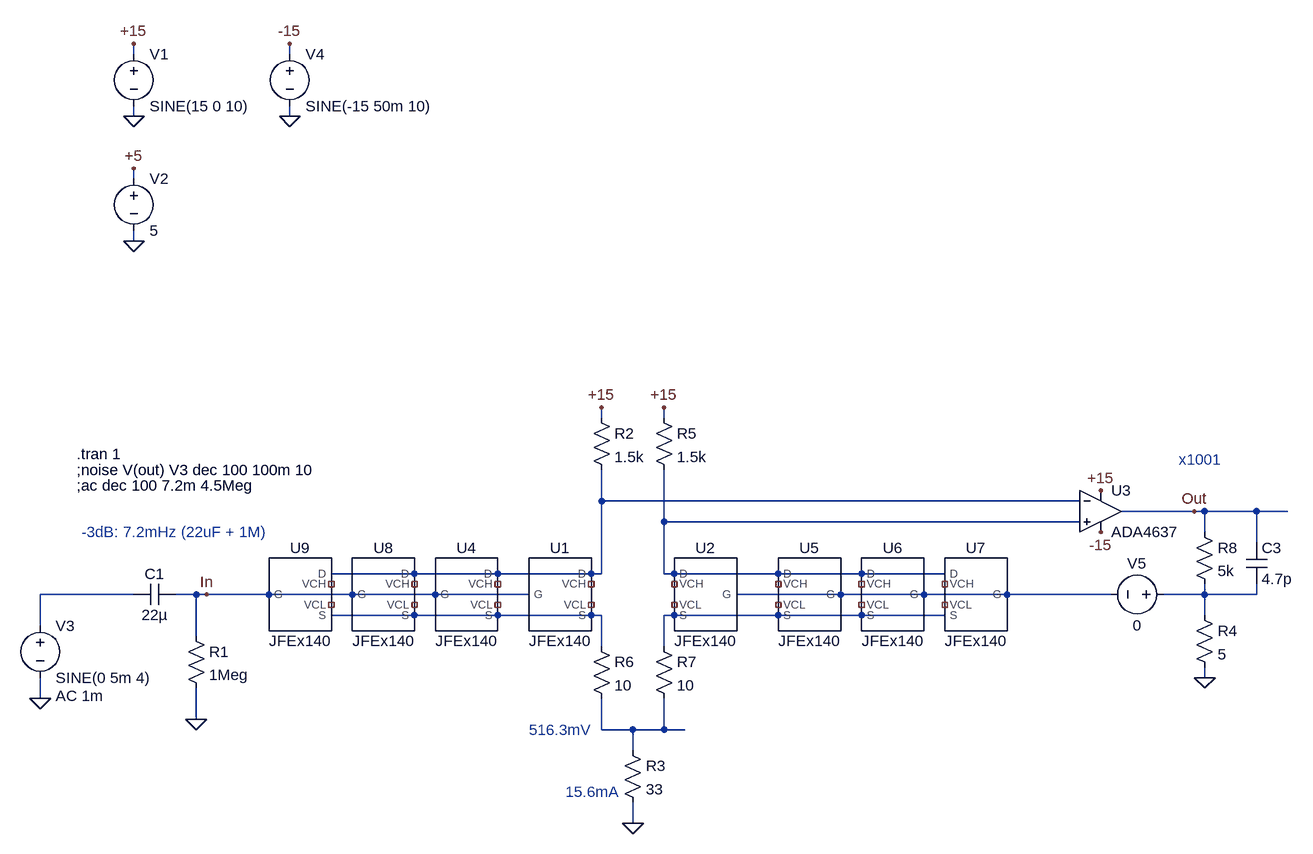
[diagram p0: schematic Differential JFET amplifier.asc]
Differential JFET amplifier.asc, the LTspice schematic file:
Version 4
SHEET 1 2084 932
WIRE -480 -672 -480 -688
WIRE -240 -672 -240 -688
WIRE -480 -576 -480 -592
WIRE -240 -576 -240 -592
WIRE -480 -480 -480 -496
WIRE -480 -384 -480 -400
WIRE 240 -112 240 -128
WIRE 336 -112 336 -128
WIRE 240 16 240 -32
WIRE 976 16 240 16
WIRE 1152 32 1040 32
WIRE 1168 32 1152 32
WIRE 1248 32 1168 32
WIRE 1296 32 1248 32
WIRE 336 48 336 -32
WIRE 976 48 336 48
WIRE 1168 64 1168 32
WIRE 1248 80 1248 32
WIRE -48 128 -176 128
WIRE 80 128 -48 128
WIRE 224 128 80 128
WIRE 240 128 240 16
WIRE 240 128 224 128
WIRE 336 128 336 48
WIRE 352 128 336 128
WIRE 512 128 352 128
WIRE 640 128 512 128
WIRE 768 128 640 128
WIRE -480 160 -624 160
WIRE -384 160 -416 160
WIRE -368 160 -384 160
WIRE -272 160 -368 160
WIRE -144 160 -272 160
WIRE -16 160 -144 160
WIRE 128 160 -16 160
WIRE 608 160 448 160
WIRE 736 160 608 160
WIRE 864 160 736 160
WIRE 1024 160 864 160
WIRE 1168 160 1168 144
WIRE 1168 160 1104 160
WIRE 1248 160 1248 144
WIRE 1248 160 1168 160
WIRE -48 192 -176 192
WIRE 80 192 -48 192
WIRE 224 192 80 192
WIRE 240 192 224 192
WIRE 352 192 336 192
WIRE 512 192 352 192
WIRE 640 192 512 192
WIRE 768 192 640 192
WIRE 1168 192 1168 160
WIRE -624 208 -624 160
WIRE -384 224 -384 160
WIRE 240 240 240 192
WIRE 336 240 336 192
WIRE 1168 288 1168 272
WIRE -624 320 -624 288
WIRE -384 352 -384 304
WIRE 240 368 240 320
WIRE 288 368 240 368
WIRE 336 368 336 320
WIRE 336 368 288 368
WIRE 368 368 336 368
WIRE 288 400 288 368
WIRE 288 512 288 480
FLAG -480 -688 +15
FLAG -480 -576 0
FLAG 288 512 0
FLAG -384 352 0
FLAG -624 320 0
FLAG -240 -688 -15
FLAG -240 -576 0
FLAG 1008 0 +15
FLAG 1008 64 -15
FLAG 1152 32 Out
FLAG 240 -128 +15
FLAG 336 -128 +15
FLAG 1168 288 0
FLAG -480 -496 +5
FLAG -480 -384 0
FLAG -368 160 In
DATAFLAG -576 160 ""
SYMBOL JFEx140 176 160 R0
SYMATTR InstName U1
SYMBOL JFEx140 400 160 M0
SYMATTR InstName U2
SYMBOL cap -416 144 R90
WINDOW 0 0 32 VBottom 2
WINDOW 3 32 32 VTop 2
SYMATTR InstName C1
SYMATTR Value 22µ
SYMBOL res -400 208 R0
SYMATTR InstName R1
SYMATTR Value 1Meg
SYMBOL voltage -480 -688 R0
WINDOW 123 0 0 Left 0
WINDOW 39 0 0 Left 0
SYMATTR InstName V1
SYMATTR Value SINE(15 0 10)
SYMBOL voltage -624 192 R0
WINDOW 123 24 124 Left 2
WINDOW 39 0 0 Left 0
SYMATTR Value2 AC 1m
SYMATTR InstName V3
SYMATTR Value SINE(0 5m 4)
SYMBOL voltage -240 -688 R0
WINDOW 123 0 0 Left 0
WINDOW 39 0 0 Left 0
SYMATTR InstName V4
SYMATTR Value SINE(-15 50m 10)
SYMBOL res 272 384 R0
SYMATTR InstName R3
SYMATTR Value 33
SYMBOL OpAmps\\ADA4637 1008 -32 R0
SYMATTR InstName U3
SYMBOL res 224 -128 R0
SYMATTR InstName R2
SYMATTR Value 1.5k
SYMBOL res 320 -128 R0
SYMATTR InstName R5
SYMATTR Value 1.5k
SYMBOL res 224 224 R0
SYMATTR InstName R6
SYMATTR Value 10
SYMBOL res 320 224 R0
SYMATTR InstName R7
SYMATTR Value 10
SYMBOL res 1152 176 R0
SYMATTR InstName R4
SYMATTR Value 5
SYMBOL res 1152 48 R0
SYMATTR InstName R8
SYMATTR Value 5k
SYMBOL voltage -480 -496 R0
WINDOW 123 0 0 Left 0
WINDOW 39 0 0 Left 0
SYMATTR InstName V2
SYMATTR Value 5
SYMBOL JFEx140 32 160 R0
SYMATTR InstName U4
SYMBOL JFEx140 560 160 M0
SYMATTR InstName U5
SYMBOL JFEx140 688 160 M0
SYMATTR InstName U6
SYMBOL JFEx140 816 160 M0
SYMATTR InstName U7
SYMBOL JFEx140 -96 160 R0
SYMATTR InstName U8
SYMBOL JFEx140 -224 160 R0
SYMATTR InstName U9
SYMBOL cap 1232 80 R0
SYMATTR InstName C3
SYMATTR Value 4.7p
SYMBOL voltage 1120 160 R90
WINDOW 0 -32 56 VBottom 2
WINDOW 3 32 56 VTop 2
WINDOW 123 0 0 Left 0
WINDOW 39 0 0 Left 0
SYMATTR InstName V5
SYMATTR Value 0
TEXT -568 -56 Left 2 !.tran 1
TEXT -568 -32 Left 2 !;noise V(out) V3 dec 100 100m 10
TEXT -568 -8 Left 2 !;ac dec 100 7.2m 4.5Meg
TEXT -560 64 Left 2 ;-3dB: 7.2mHz (22uF + 1M)
TEXT 1128 -48 Left 2 ;x1001
TEXT 128 368 Left 2 ;516.3mV
TEXT 184 464 Left 2 ;15.6mA

The netlist it stands for:
* Differential JFET amplifier.asc
XU1 N001 In N006 NC_01 NC_02 JFEx140  ; pins D G S VCH VCL
XU2 N002 N004 N007 NC_03 NC_04 JFEx140  ; pins D G S VCH VCL
C1 In N003 22µ
R1 In 0 1Meg
V1 +15 0 SINE(15 0 10)
V3 N003 0 SINE(0 5m 4) AC 1m
V4 -15 0 SINE(-15 50m 10)
R3 N008 0 33
XU3 N002 N001 +15 -15 Out ADA4637  ; pins In+ In- V+ V- OUT
R2 +15 N001 1.5k
R5 +15 N002 1.5k
R6 N006 N008 10
R7 N007 N008 10
R4 N005 0 5
R8 Out N005 5k
V2 +5 0 5
XU4 N001 In N006 NC_05 NC_06 JFEx140  ; pins D G S VCH VCL
XU5 N002 N004 N007 NC_07 NC_08 JFEx140  ; pins D G S VCH VCL
XU6 N002 N004 N007 NC_09 NC_10 JFEx140  ; pins D G S VCH VCL
XU7 N002 N004 N007 NC_11 NC_12 JFEx140  ; pins D G S VCH VCL
XU8 N001 In N006 NC_13 NC_14 JFEx140  ; pins D G S VCH VCL
XU9 N001 In N006 NC_15 NC_16 JFEx140  ; pins D G S VCH VCL
C3 Out N005 4.7p
V5 N005 N004 0
.tran 1
;noise V(out) V3 dec 100 100m 10
;ac dec 100 7.2m 4.5Meg
* -3dB: 7.2mHz (22uF + 1M)
* x1001
* 516.3mV
* 15.6mA
.lib C:\GitHub\PCBs\LNA\Simulations\jfex140.lib
.backanno
.end